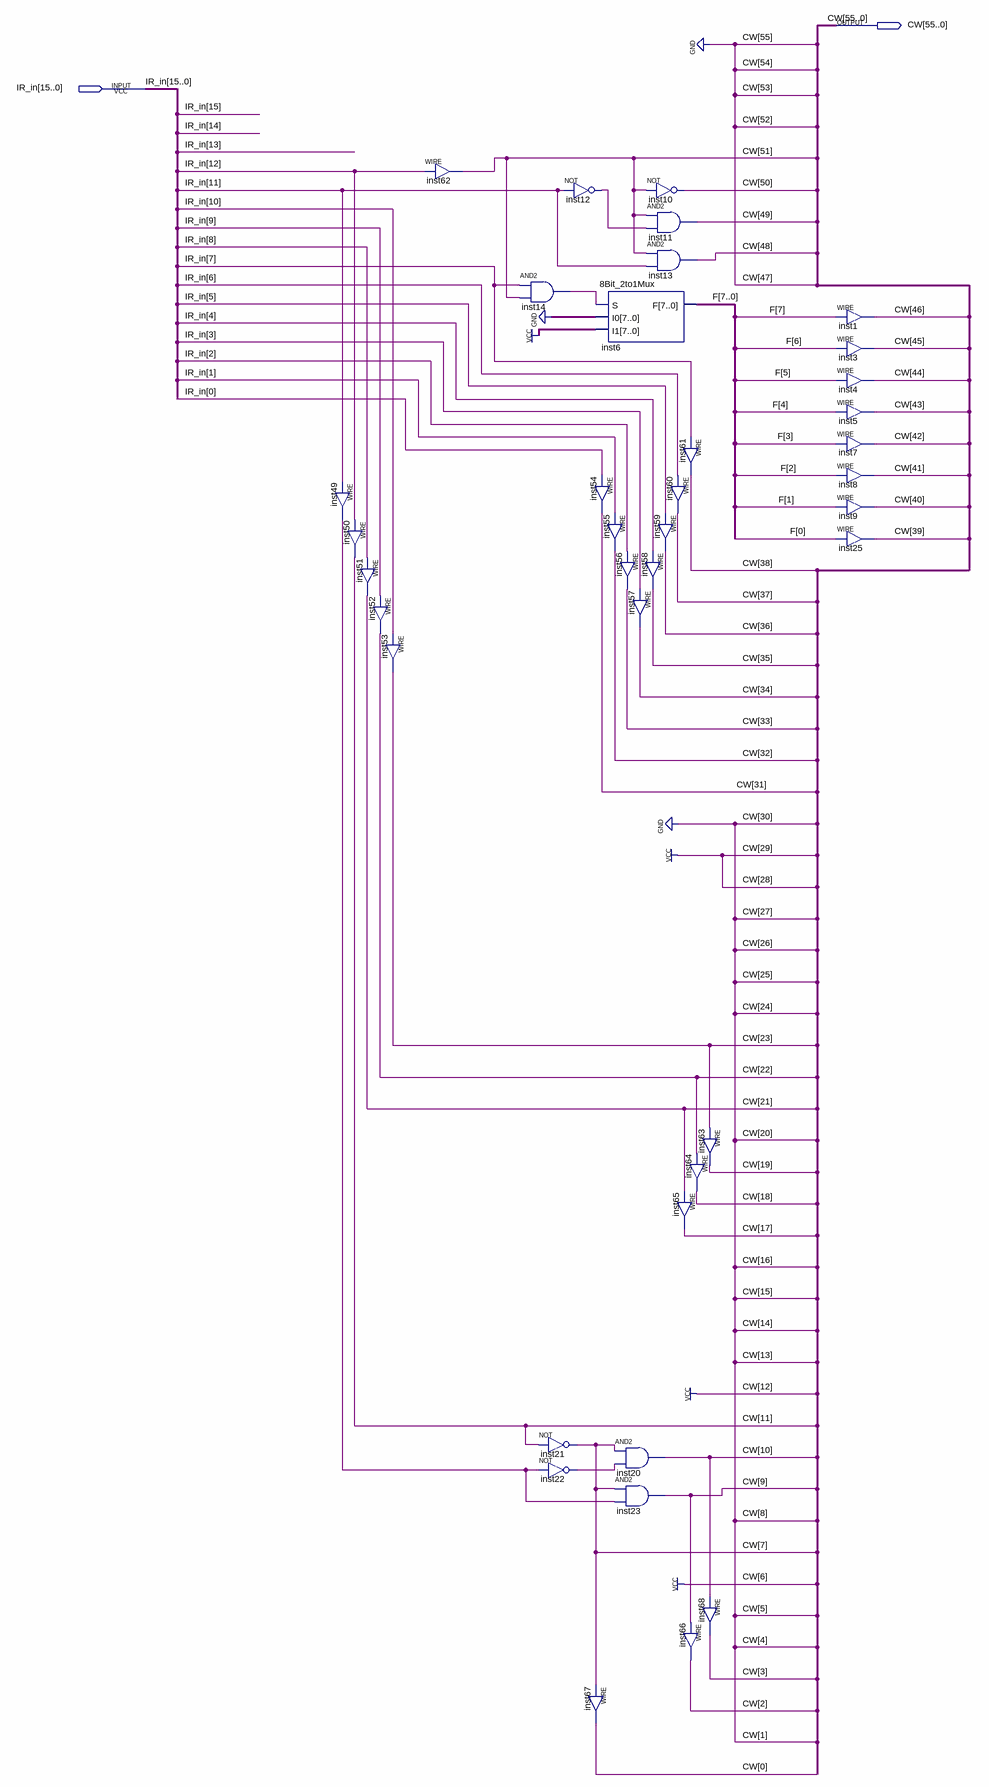
[diagram p0: schematic sheet]
// Quartus schematic Execute0_10_Mem_PCont.bdf as structural Verilog: 38 symbols, 2 pins
module Execute0_10_Mem_PCont (
  input  [15:0] IR_in,
  output [55:0] CW
);

  wire inst12_out, inst14_out, inst22_out, inst49_out;
  wire [7:0] F;

  assign inst49_out = IR_in[11];  // WIRE inst49
  assign CW[11] = IR_in[12];  // WIRE inst50
  assign CW[21] = IR_in[8];  // WIRE inst51
  assign CW[22] = IR_in[9];  // WIRE inst52
  assign CW[23] = IR_in[10];  // WIRE inst53
  assign CW[51] = IR_in[12];  // WIRE inst62
  and inst14 (inst14_out, IR_in[7], CW[51]);
  not inst21 (CW[7], CW[11]);
  not inst22 (inst22_out, inst49_out);
  not inst12 (inst12_out, IR_in[11]);
  assign CW[31] = IR_in[0];  // WIRE inst54
  assign CW[0] = CW[7];  // WIRE inst67
  \8Bit_2to1Mux  inst6 (.S(inst14_out), .I0({8{1'b0}}), .I1({8{1'b1}}), .F(F));
  assign CW[32] = IR_in[1];  // WIRE inst55
  assign CW[33] = IR_in[2];  // WIRE inst56
  assign CW[35] = IR_in[4];  // WIRE inst58
  assign CW[34] = IR_in[3];  // WIRE inst57
  and inst20 (CW[10], CW[7], inst22_out);
  and inst23 (CW[9], CW[7], inst49_out);
  not inst10 (CW[50], CW[51]);
  and inst11 (CW[49], CW[51], inst12_out);
  and inst13 (CW[48], CW[51], IR_in[11]);
  assign CW[38] = IR_in[7];  // WIRE inst61
  assign CW[37] = IR_in[6];  // WIRE inst60
  assign CW[36] = IR_in[5];  // WIRE inst59
  assign CW[18] = CW[22];  // WIRE inst64
  assign CW[17] = CW[21];  // WIRE inst65
  assign CW[2] = CW[9];  // WIRE inst66
  assign CW[19] = CW[23];  // WIRE inst63
  assign CW[3] = CW[10];  // WIRE inst68
  assign CW[46] = F[7];  // WIRE inst1
  assign CW[45] = F[6];  // WIRE inst3
  assign CW[44] = F[5];  // WIRE inst4
  assign CW[43] = F[4];  // WIRE inst5
  assign CW[42] = F[3];  // WIRE inst7
  assign CW[41] = F[2];  // WIRE inst8
  assign CW[40] = F[1];  // WIRE inst9
  assign CW[39] = F[0];  // WIRE inst25

  assign {CW[55:52], CW[47], CW[30:24], CW[20], CW[16:12], CW[8], CW[6:4], CW[1]} = 23'b00000011000000000101000;
endmodule
